# Altium schematic sheet Hydrophone2012.SchDoc
size A
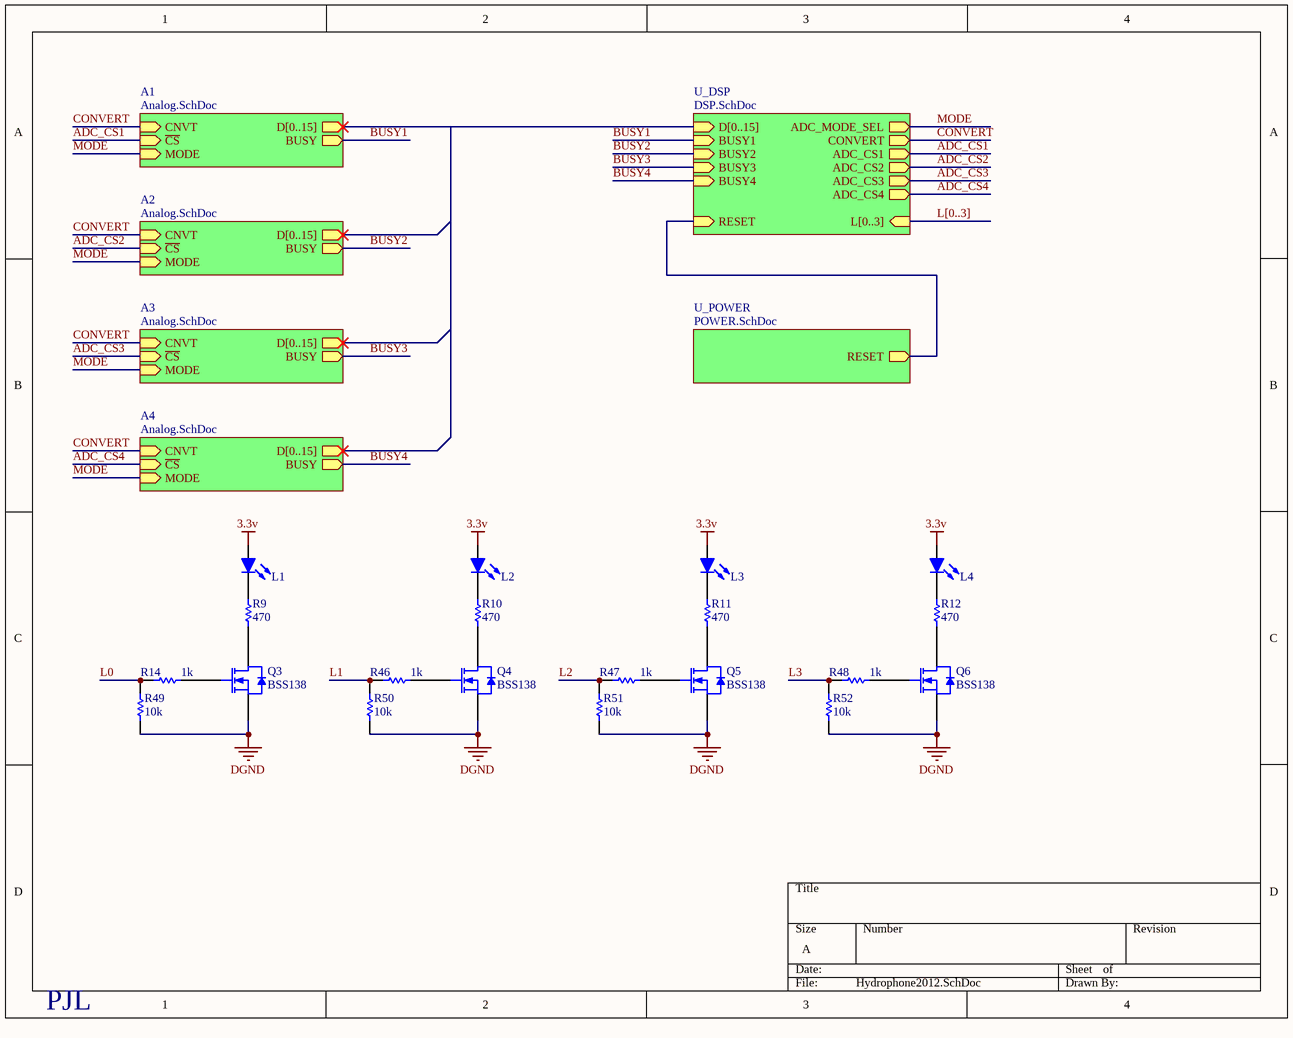
[diagram p0: Hydrophone2012.SchDoc]

## Parts
L1  LED-RED  [LED0805-RED]  (value not drawn)
L2  LED-RED  [LED0805-RED]  (value not drawn)
L3  LED-RED  [LED0805-RED]  (value not drawn)
L4  LED-RED  [LED0805-RED]  (value not drawn)
LOGO1  UF LOGO  [UF LOGO-1000]  (value not drawn)
LOGO2  SubjuGator Logo  [SubjuGator-1200]  (value not drawn)
MIL  MIL LOGO  [MIL LOGO - 600P]  (value not drawn)
Q3  BSS138  [SOT95P237X111-3L]
Q4  BSS138  [SOT95P237X111-3L]
Q5  BSS138  [SOT95P237X111-3L]
Q6  BSS138  [SOT95P237X111-3L]
R9  470  [RESC1608XN]
R10  470  [RESC1608XN]
R11  470  [RESC1608XN]
R12  470  [RESC1608XN]
R14  1k  [RESC1608XL]
R46  1k  [RESC1608XL]
R47  1k  [RESC1608XL]
R48  1k  [RESC1608XL]
R49  10k  [RESC1608XL]
R50  10k  [RESC1608XL]
R51  10k  [RESC1608XL]
R52  10k  [RESC1608XL]

## Sub-sheets
A1 = Analog.SchDoc: D[0..15] (out, harness Harness), CNVT (in), BUSY (out), ~{CS} (in), MODE (in)
A2 = Analog.SchDoc: D[0..15] (out), CNVT (in), BUSY (out), ~{CS} (in), MODE (in)
A3 = Analog.SchDoc: D[0..15] (out), CNVT (in), BUSY (out), ~{CS} (in), MODE (in)
A4 = Analog.SchDoc: D[0..15] (out), CNVT (in), BUSY (out), ~{CS} (in), MODE (in)
U_DSP = DSP.SchDoc: ADC_MODE_SEL (out), D[0..15] (in), CONVERT (out), ADC_CS1 (out), ADC_CS2 (out), ADC_CS3 (out), ADC_CS4 (out), BUSY1 (in), BUSY2 (in), BUSY3 (in), BUSY4 (in), RESET (in), L[0..3] (in)
U_POWER = POWER.SchDoc: RESET (out)

## Nets
3.3v: L1.2(A) L2.2(A) L3.2(A) L4.2(A)
DGND: Q3.2(S) Q4.2(S) Q5.2(S) Q6.2(S) R49.2 R50.2 R51.2 R52.2
ADC_CS1: sheet A1/~{CS}, sheet U_DSP/ADC_CS1
ADC_CS2: sheet A2/~{CS}, sheet U_DSP/ADC_CS2
ADC_CS3: sheet A3/~{CS}, sheet U_DSP/ADC_CS3
ADC_CS4: sheet A4/~{CS}, sheet U_DSP/ADC_CS4
BUSY1: sheet A1/BUSY, sheet U_DSP/BUSY1
BUSY2: sheet A2/BUSY, sheet U_DSP/BUSY2
BUSY3: sheet A3/BUSY, sheet U_DSP/BUSY3
BUSY4: sheet A4/BUSY, sheet U_DSP/BUSY4
CONVERT: sheet A1/CNVT, sheet A2/CNVT, sheet A3/CNVT, sheet A4/CNVT, sheet U_DSP/CONVERT
L0: R14.1 R49.1
L1: R46.1 R50.1
L2: R47.1 R51.1
L3: R48.1 R52.1
MODE: sheet A1/MODE, sheet A2/MODE, sheet A3/MODE, sheet A4/MODE, sheet U_DSP/ADC_MODE_SEL
NetL1_1: L1.1(K) R9.2
NetL2_1: L2.1(K) R10.2
NetL3_1: L3.1(K) R11.2
NetL4_1: L4.1(K) R12.2
NetQ3_1: Q3.1(G) R14.2
NetQ3_3: Q3.3(D) R9.1
NetQ4_1: Q4.1(G) R46.2
NetQ4_3: Q4.3(D) R10.1
NetQ5_1: Q5.1(G) R47.2
NetQ5_3: Q5.3(D) R11.1
NetQ6_1: Q6.1(G) R48.2
NetQ6_3: Q6.3(D) R12.1
(unnamed): sheet U_POWER/RESET, sheet U_DSP/RESET

## Buses and harness runs
bus L[0..3] = sheet U_DSP/L[0..3]
bus sheet A2/D[0..15] = sheet A3/D[0..15] = sheet A4/D[0..15] = sheet U_DSP/D[0..15]

## Notes on the sheet
- (near LOGO1) PJL

## Library data of the parts
L1-L4 = LED-RED: Light Emitting Diode - RED; Manufacturer Part Number: LTST-C170CKT; Manufacturer: Lite-On Inc; Millicandela Rating: 10mcd; Viewing Angle: 130°; Voltage - Forward (Vf) Typ: 1.8V; Current - Test: 10mA; Package / Case: 0805 (2012 Metric); Color: Red; Supplier Part Number: 160-1176-2-ND; Supplier: Digi-Key
Q3-Q6 = BSS138: 200ma N-Channel Mosfet; Manufacturer Part Number: BSS138LT1G; Manufacturer: ON Semiconductor; Supplier Part Number: BSS138LT1GOSCT-ND; Supplier: Digi-Key; Package / Case: TO-236-3, SC-59, SOT-23-3
R9-R12 = RES-CHIP: RES 470 OHM .25W 5% 0603 SMD; Manufacturer: Vishay Dale; Manufacturer Part Number: CRCW0603470RJNEAHP; Power (Watts): 0.25W, 1/4W; Supplier Part Number: 541-470SACT-ND; Supplier: Digi-Key; Resistance (Ohms): 470; Package / Case: 0603 (1608 Metric); Tolerance: ±5%
R14 R46-R48 = RES-CHIP: Resistor Chip; Manufacturer: Yageo; Manufacturer Part Number: RC0603JR-071KL; Tolerance: ±5%; Power (Watts): 0.1W, 1/10W; Supplier Part Number: 311-1.0KGRCT-ND; Supplier: Digi-Key; Package / Case: 0603 (1608 Metric); Resistance (Ohms): 1k
R49-R52 = RES-CHIP: Resistor Chip; Manufacturer: Yageo; Manufacturer Part Number: RC0603JR-0710KL; Tolerance: ±5%; Power (Watts): 0.1W, 1/10W; Supplier Part Number: 311-10KGRCT-ND; Supplier: Digi-Key; Package / Case: 0603 (1608 Metric); Resistance (Ohms): 10k